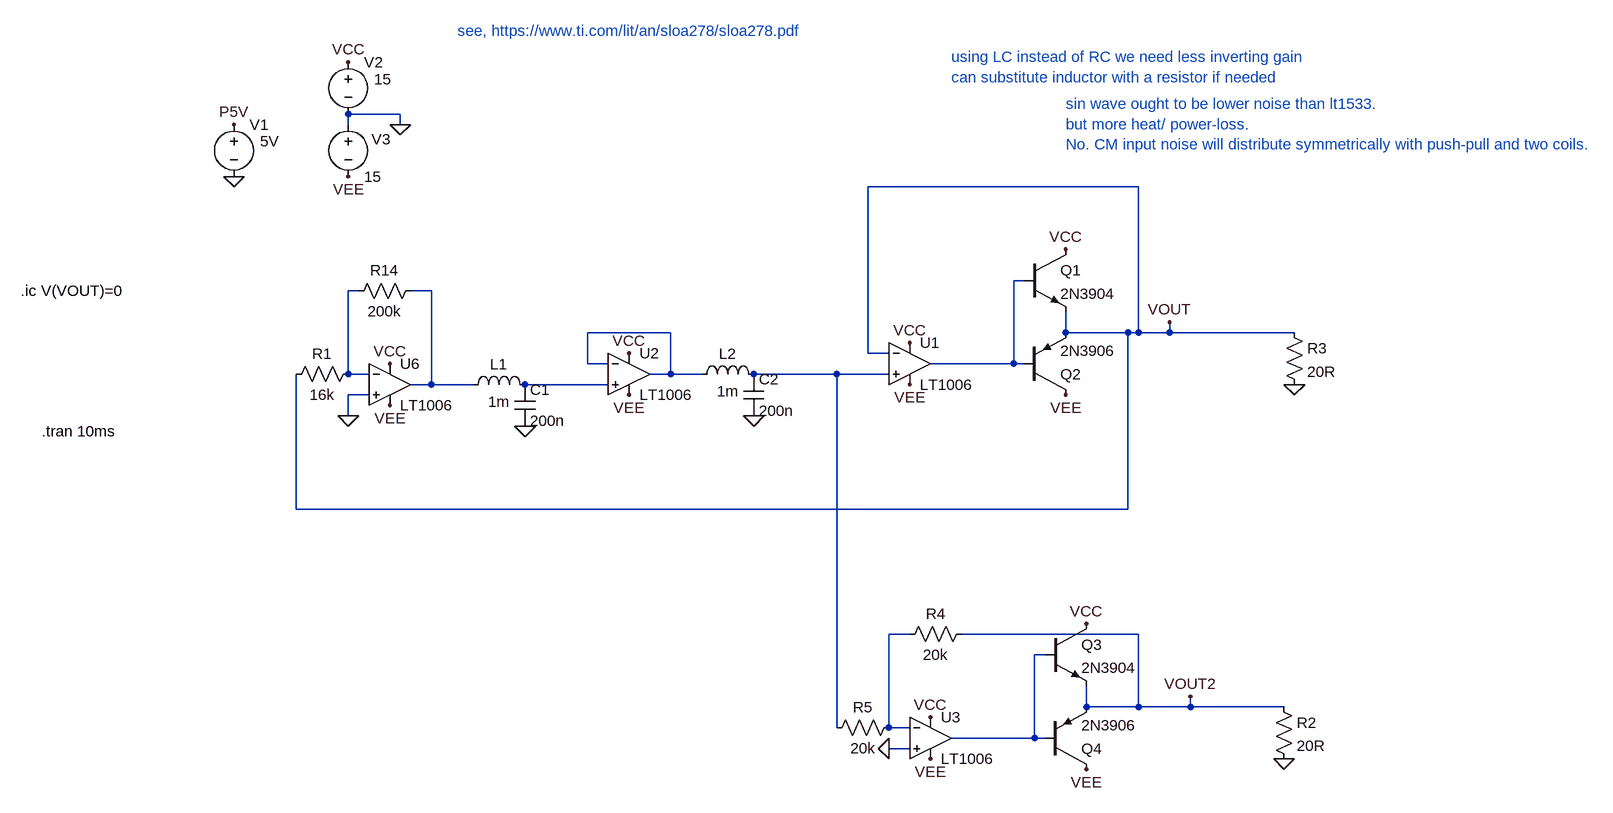
[diagram p0: schematic Draft03.asc]
Draft03.asc, the LTspice schematic file:
Version 4
SHEET 1 2720 1004
WIRE -496 -112 -576 -112
WIRE -576 -96 -576 -112
WIRE -496 -96 -496 -112
WIRE 640 0 224 0
WIRE 464 144 448 144
WIRE -560 160 -576 160
WIRE -448 160 -480 160
WIRE -80 224 -208 224
WIRE 528 224 528 192
WIRE 624 224 528 224
WIRE 640 224 640 0
WIRE 640 224 624 224
WIRE 688 224 688 208
WIRE 688 224 640 224
WIRE 880 224 688 224
WIRE 224 256 224 0
WIRE 256 256 224 256
WIRE -208 272 -208 224
WIRE -176 272 -208 272
WIRE 448 272 448 144
WIRE 448 272 320 272
WIRE 464 272 448 272
WIRE -576 288 -576 160
WIRE -544 288 -576 288
WIRE -80 288 -80 224
WIRE -80 288 -112 288
WIRE -32 288 -80 288
WIRE 176 288 48 288
WIRE 256 288 176 288
WIRE -448 304 -448 160
WIRE -448 304 -480 304
WIRE -384 304 -448 304
WIRE -176 304 -304 304
WIRE -544 320 -576 320
WIRE -576 352 -576 320
WIRE -656 496 -656 288
WIRE 624 496 624 224
WIRE 624 496 -656 496
WIRE 288 688 256 688
WIRE 640 688 368 688
WIRE 496 720 480 720
WIRE 560 800 560 768
WIRE 640 800 640 688
WIRE 640 800 560 800
WIRE 720 800 720 784
WIRE 720 800 640 800
WIRE 864 800 720 800
WIRE 176 832 176 288
WIRE 256 832 256 688
WIRE 288 832 256 832
WIRE 480 848 480 720
WIRE 480 848 352 848
WIRE 496 848 480 848
WIRE 288 864 256 864
FLAG -496 -96 0
FLAG -576 -192 VCC
FLAG -576 -16 VEE
FLAG -752 -96 P5V
FLAG -752 -16 0
FLAG -576 352 0
FLAG -512 272 VCC
FLAG -512 336 VEE
FLAG -304 368 0
FLAG 288 240 VCC
FLAG 288 304 VEE
FLAG 688 208 VOUT
FLAG -144 256 VCC
FLAG -144 320 VEE
FLAG 48 352 0
FLAG 528 96 VCC
FLAG 528 320 VEE
FLAG 880 304 0
FLAG 320 816 VCC
FLAG 320 880 VEE
FLAG 720 784 VOUT2
FLAG 560 672 VCC
FLAG 560 896 VEE
FLAG 864 880 0
FLAG 256 864 0
SYMBOL voltage -576 -208 R0
WINDOW 123 0 0 Left 0
WINDOW 39 0 0 Left 0
WINDOW 3 40 42 Left 2
SYMATTR Value 15
SYMATTR InstName V2
SYMBOL voltage -576 -112 R0
WINDOW 123 0 0 Left 0
WINDOW 39 0 0 Left 0
WINDOW 0 36 39 Left 2
SYMATTR InstName V3
SYMATTR Value 15
SYMBOL voltage -752 -112 R0
WINDOW 123 0 0 Left 0
WINDOW 39 0 0 Left 0
WINDOW 3 40 42 Left 2
SYMATTR Value 5V
SYMATTR InstName V1
SYMBOL OpAmps\\LT1006 -512 240 R0
SYMATTR InstName U6
SYMBOL res -560 272 R90
WINDOW 0 0 56 VBottom 2
WINDOW 3 32 56 VTop 2
SYMATTR InstName R1
SYMATTR Value 16k
SYMBOL res -464 144 R90
WINDOW 0 0 56 VBottom 2
WINDOW 3 32 56 VTop 2
SYMATTR InstName R14
SYMATTR Value 200k
SYMBOL cap -320 304 R0
SYMATTR InstName C1
SYMATTR Value 200n
SYMBOL OpAmps\\LT1006 288 208 R0
SYMATTR InstName U1
SYMBOL OpAmps\\LT1006 -144 224 R0
SYMATTR InstName U2
SYMBOL cap 32 288 R0
SYMATTR InstName C2
SYMATTR Value 200n
SYMBOL npn 464 96 R0
SYMATTR InstName Q1
SYMATTR Value 2N3904
SYMBOL pnp 464 320 M180
SYMATTR InstName Q2
SYMATTR Value 2N3906
SYMBOL res 864 208 R0
SYMATTR InstName R3
SYMATTR Value 20R
SYMBOL ind -400 320 R270
WINDOW 0 32 56 VTop 2
WINDOW 3 5 56 VBottom 2
SYMATTR InstName L1
SYMATTR Value 1m
SYMBOL ind -48 304 R270
WINDOW 0 32 56 VTop 2
WINDOW 3 5 56 VBottom 2
SYMATTR InstName L2
SYMATTR Value 1m
SYMBOL OpAmps\\LT1006 320 784 R0
SYMATTR InstName U3
SYMBOL npn 496 672 R0
SYMATTR InstName Q3
SYMATTR Value 2N3904
SYMBOL pnp 496 896 M180
SYMATTR InstName Q4
SYMATTR Value 2N3906
SYMBOL res 848 784 R0
SYMATTR InstName R2
SYMATTR Value 20R
SYMBOL res 384 672 R90
WINDOW 0 0 56 VBottom 2
WINDOW 3 32 56 VTop 2
SYMATTR InstName R4
SYMATTR Value 20k
SYMBOL res 160 848 R270
WINDOW 0 32 56 VTop 2
WINDOW 3 0 56 VBottom 2
SYMATTR InstName R5
SYMATTR Value 20k
TEXT -1048 376 Left 2 !.tran 10ms
TEXT -1080 160 Left 2 !.ic V(VOUT)=0
TEXT -408 -240 Left 2 ;see, https://www.ti.com/lit/an/sloa278/sloa278.pdf
TEXT 352 -200 Left 2 ;using LC instead of RC we need less inverting gain\ncan substitute inductor with a resistor if needed
TEXT 528 -128 Left 2 ;sin wave ought to be lower noise than lt1533.\nbut more heat/ power-loss.\nNo. CM input noise will distribute symmetrically with push-pull and two coils.

The netlist it stands for:
* Draft03.asc
V2 VCC 0 15
V3 0 VEE 15
V1 P5V 0 5V
XU6 0 N002 VCC VEE N003 LT1006  ; pins In+ In- V+ V- OUT
R1 N002 VOUT 16k
R14 N003 N002 200k
C1 N006 0 200n
XU1 N005 VOUT VCC VEE N001 LT1006  ; pins In+ In- V+ V- OUT
XU2 N006 N004 VCC VEE N004 LT1006  ; pins In+ In- V+ V- OUT
C2 N005 0 200n
Q1 VCC N001 VOUT 0 2N3904
Q2 VEE N001 VOUT 0 2N3906
R3 VOUT 0 20R
L1 N003 N006 1m
L2 N004 N005 1m
XU3 0 N007 VCC VEE N008 LT1006  ; pins In+ In- V+ V- OUT
Q3 VCC N008 VOUT2 0 2N3904
Q4 VEE N008 VOUT2 0 2N3906
R2 VOUT2 0 20R
R4 VOUT2 N007 20k
R5 N005 N007 20k
.model NPN NPN
.model PNP PNP
.lib standard.bjt
.tran 10ms
.ic V(VOUT)=0
* see, https://www.ti.com/lit/an/sloa278/sloa278.pdf
* using LC instead of RC we need less inverting gain
* can substitute inductor with a resistor if needed
* sin wave ought to be lower noise than lt1533.
* but more heat/ power-loss.
* No. CM input noise will distribute symmetrically with push-pull and two coils.
.lib LTC.lib
.backanno
.end